# Altium schematic sheet FPGA_Core.SchDoc: FPGA Core Module
size 420 x 297 mm; DocumentNumber: 8; SheetNumber: 8; SheetTotal: 16
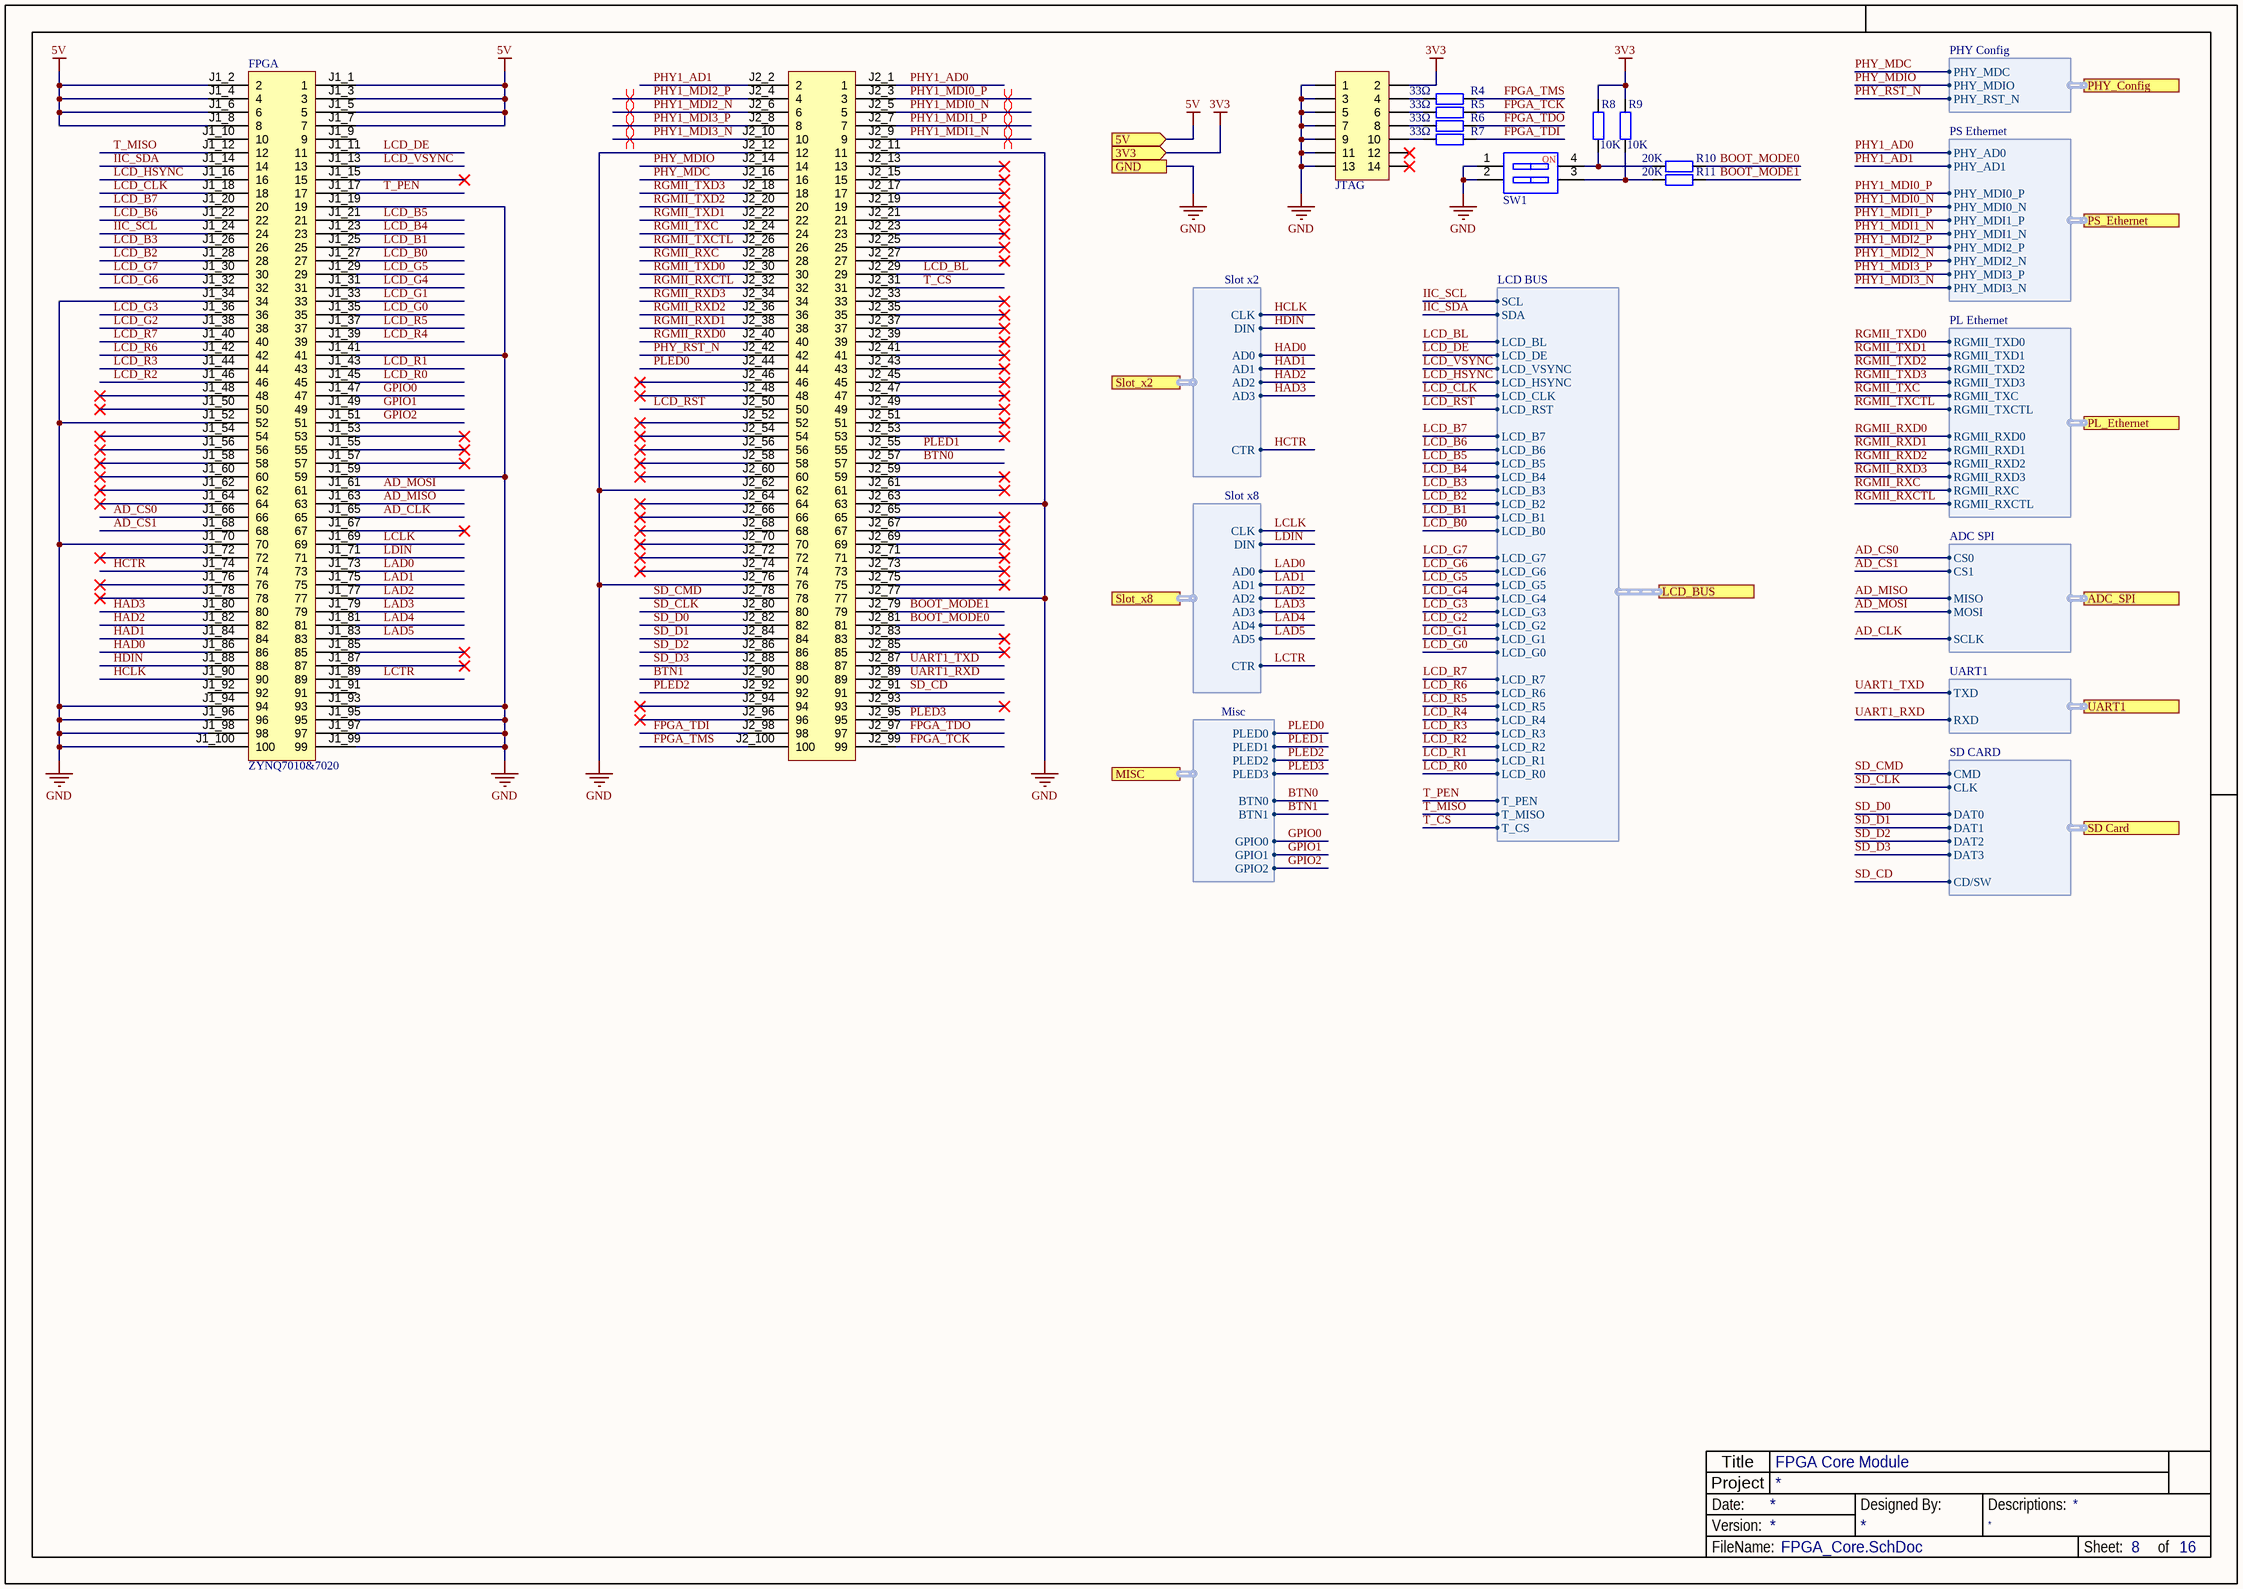
[diagram p0: FPGA_Core.SchDoc]

## Parts
FPGA  ZYNQ7010&7020  [ZYNQ7010&7020_CB]
JTAG  Header 2X7  [IDC2.54-LI-2x7P]  (value not drawn)
R4  33Ω  [R 0603_L]
R5  33Ω  [R 0603_L]
R6  33Ω  [R 0603_L]
R7  33Ω  [R 0603_L]
R8  10K  [R 0603_L]
R9  10K  [R 0603_L]
R10  20K  [R 0603_L]
R11  20K  [R 0603_L]
SW1  SW-2P  [CSW DIP-2P]  (value not drawn)

## Ports
3V3 (in), 5V (in), ADC_SPI (harness ADC SPI), GND, LCD_BUS (harness LCD BUS), MISC (harness Misc), PHY_Config (harness PHY Config), PL_Ethernet (harness PL Ethernet), PS_Ethernet (harness PS Ethernet), SD Card (harness SD CARD), Slot_x2 (harness Slot x2), Slot_x8 (harness Slot x8), UART1 (harness UART1)

## Harnesses
Slot x2: CLK, DIN, AD0, AD1, AD2, AD3, CTR
Slot x8: CLK, DIN, AD0, AD1, AD2, AD3, AD4, AD5, CTR
PHY Config: PHY_MDC, PHY_MDIO, PHY_RST_N
PS Ethernet: PHY_AD0, PHY_AD1, PHY_MDI0_P, PHY_MDI0_N, PHY_MDI1_P, PHY_MDI1_N, PHY_MDI2_P, PHY_MDI2_N, PHY_MDI3_P, PHY_MDI3_N
PL Ethernet: RGMII_TXD0, RGMII_TXD1, RGMII_TXD2, RGMII_TXD3, RGMII_TXC, RGMII_TXCTL, RGMII_RXD0, RGMII_RXD1, RGMII_RXD2, RGMII_RXD3, RGMII_RXC, RGMII_RXCTL
ADC SPI: CS0, CS1, MISO, MOSI, SCLK
UART1: TXD, RXD
SD CARD: CMD, CLK, DAT0, DAT1, DAT2, DAT3, CD/SW
LCD BUS: SCL, SDA, LCD_R0, LCD_R1, LCD_R2, LCD_R3, LCD_R4, LCD_R5, LCD_R6, LCD_R7, LCD_G0, LCD_G1, LCD_G2, LCD_G3, LCD_G4, LCD_G5, LCD_G6, LCD_G7, LCD_B0, LCD_B1, LCD_B2, LCD_B3, LCD_B4, LCD_B5, LCD_B6, LCD_B7, LCD_RST, LCD_CLK, LCD_HSYNC, LCD_VSYNC, LCD_DE, LCD_BL, T_PEN, T_MISO, T_CS
Misc: PLED0, PLED1, PLED2, PLED3, BTN1, BTN0, GPIO0, GPIO1, GPIO2

## Nets
3V3: JTAG.2 R8.2 R9.2 ; port 3V3
5V: FPGA.J1_1(1) FPGA.J1_2(2) FPGA.J1_3(3) FPGA.J1_4(4) FPGA.J1_5(5) FPGA.J1_6(6) FPGA.J1_7(7) FPGA.J1_8(8) ; port 5V
GND: FPGA.J1_19(19) FPGA.J1_34(34) FPGA.J1_41(41) FPGA.J1_52(52) FPGA.J1_59(59) FPGA.J1_70(70) FPGA.J1_93(93) FPGA.J1_94(94) FPGA.J1_95(95) FPGA.J1_96(96) FPGA.J1_97(97) FPGA.J1_98(98) FPGA.J1_99(99) FPGA.J1_100(100) FPGA.J2_11(11) FPGA.J2_12(12) FPGA.J2_62(62) FPGA.J2_63(63) FPGA.J2_76(76) FPGA.J2_77(77) JTAG.1 JTAG.3 JTAG.5 JTAG.7 JTAG.9 JTAG.11 JTAG.13 SW1.1 SW1.2 ; port GND
AD_CLK: FPGA.J1_65(65) ; port ADC_SPI.SCLK
AD_CS0: FPGA.J1_66(66) ; port ADC_SPI.CS0
AD_CS1: FPGA.J1_68(68) ; port ADC_SPI.CS1
AD_MISO: FPGA.J1_63(63) ; port ADC_SPI.MISO
AD_MOSI: FPGA.J1_61(61) ; port ADC_SPI.MOSI
BOOT_MODE0: FPGA.J2_81(81) R10.2
BOOT_MODE1: FPGA.J2_79(79) R11.2
BTN0: FPGA.J2_57(57) ; port MISC.BTN0
BTN1: FPGA.J2_90(90) ; port MISC.BTN1
FPGA_TCK: FPGA.J2_99(99) R5.2
FPGA_TDI: FPGA.J2_98(98) R7.2
FPGA_TDO: FPGA.J2_97(97) R6.2
FPGA_TMS: FPGA.J2_100(100) R4.2
GPIO0: FPGA.J1_47(47) ; port MISC.GPIO0
GPIO1: FPGA.J1_49(49) ; port MISC.GPIO1
GPIO2: FPGA.J1_51(51) ; port MISC.GPIO2
HAD0: FPGA.J1_86(86) ; port Slot_x2.AD0
HAD1: FPGA.J1_84(84) ; port Slot_x2.AD1
HAD2: FPGA.J1_82(82) ; port Slot_x2.AD2
HAD3: FPGA.J1_80(80) ; port Slot_x2.AD3
HCLK: FPGA.J1_90(90) ; port Slot_x2.CLK
HCTR: FPGA.J1_74(74) ; port Slot_x2.CTR
HDIN: FPGA.J1_88(88) ; port Slot_x2.DIN
IIC_SCL: FPGA.J1_24(24) ; port LCD_BUS.SCL
IIC_SDA: FPGA.J1_14(14) ; port LCD_BUS.SDA
LAD0: FPGA.J1_73(73) ; port Slot_x8.AD0
LAD1: FPGA.J1_75(75) ; port Slot_x8.AD1
LAD2: FPGA.J1_77(77) ; port Slot_x8.AD2
LAD3: FPGA.J1_79(79) ; port Slot_x8.AD3
LAD4: FPGA.J1_81(81) ; port Slot_x8.AD4
LAD5: FPGA.J1_83(83) ; port Slot_x8.AD5
LCD_B0: FPGA.J1_27(27) ; port LCD_BUS.LCD_B0
LCD_B1: FPGA.J1_25(25) ; port LCD_BUS.LCD_B1
LCD_B2: FPGA.J1_28(28) ; port LCD_BUS.LCD_B2
LCD_B3: FPGA.J1_26(26) ; port LCD_BUS.LCD_B3
LCD_B4: FPGA.J1_23(23) ; port LCD_BUS.LCD_B4
LCD_B5: FPGA.J1_21(21) ; port LCD_BUS.LCD_B5
LCD_B6: FPGA.J1_22(22) ; port LCD_BUS.LCD_B6
LCD_B7: FPGA.J1_20(20) ; port LCD_BUS.LCD_B7
LCD_BL: FPGA.J2_29(29) ; port LCD_BUS.LCD_BL
LCD_CLK: FPGA.J1_18(18) ; port LCD_BUS.LCD_CLK
LCD_DE: FPGA.J1_11(11) ; port LCD_BUS.LCD_DE
LCD_G0: FPGA.J1_35(35) ; port LCD_BUS.LCD_G0
LCD_G1: FPGA.J1_33(33) ; port LCD_BUS.LCD_G1
LCD_G2: FPGA.J1_38(38) ; port LCD_BUS.LCD_G2
LCD_G3: FPGA.J1_36(36) ; port LCD_BUS.LCD_G3
LCD_G4: FPGA.J1_31(31) ; port LCD_BUS.LCD_G4
LCD_G5: FPGA.J1_29(29) ; port LCD_BUS.LCD_G5
LCD_G6: FPGA.J1_32(32) ; port LCD_BUS.LCD_G6
LCD_G7: FPGA.J1_30(30) ; port LCD_BUS.LCD_G7
LCD_HSYNC: FPGA.J1_16(16) ; port LCD_BUS.LCD_HSYNC
LCD_R0: FPGA.J1_45(45) ; port LCD_BUS.LCD_R0
LCD_R1: FPGA.J1_43(43) ; port LCD_BUS.LCD_R1
LCD_R2: FPGA.J1_46(46) ; port LCD_BUS.LCD_R2
LCD_R3: FPGA.J1_44(44) ; port LCD_BUS.LCD_R3
LCD_R4: FPGA.J1_39(39) ; port LCD_BUS.LCD_R4
LCD_R5: FPGA.J1_37(37) ; port LCD_BUS.LCD_R5
LCD_R6: FPGA.J1_42(42) ; port LCD_BUS.LCD_R6
LCD_R7: FPGA.J1_40(40) ; port LCD_BUS.LCD_R7
LCD_RST: FPGA.J2_50(50) ; port LCD_BUS.LCD_RST
LCD_VSYNC: FPGA.J1_13(13) ; port LCD_BUS.LCD_VSYNC
LCLK: FPGA.J1_69(69) ; port Slot_x8.CLK
LCTR: FPGA.J1_89(89) ; port Slot_x8.CTR
LDIN: FPGA.J1_71(71) ; port Slot_x8.DIN
PHY1_AD0: FPGA.J2_1(1) ; port PS_Ethernet.PHY_AD0
PHY1_AD1: FPGA.J2_2(2) ; port PS_Ethernet.PHY_AD1
PHY1_MDI0_N: FPGA.J2_5(5) ; port PS_Ethernet.PHY_MDI0_N
PHY1_MDI0_P: FPGA.J2_3(3) ; port PS_Ethernet.PHY_MDI0_P
PHY1_MDI1_N: FPGA.J2_9(9) ; port PS_Ethernet.PHY_MDI1_N
PHY1_MDI1_P: FPGA.J2_7(7) ; port PS_Ethernet.PHY_MDI1_P
PHY1_MDI2_N: FPGA.J2_6(6) ; port PS_Ethernet.PHY_MDI2_N
PHY1_MDI2_P: FPGA.J2_4(4) ; port PS_Ethernet.PHY_MDI2_P
PHY1_MDI3_N: FPGA.J2_10(10) ; port PS_Ethernet.PHY_MDI3_N
PHY1_MDI3_P: FPGA.J2_8(8) ; port PS_Ethernet.PHY_MDI3_P
PHY_MDC: FPGA.J2_16(16) ; port PHY_Config.PHY_MDC
PHY_MDIO: FPGA.J2_14(14) ; port PHY_Config.PHY_MDIO
PHY_RST_N: FPGA.J2_42(42) ; port PHY_Config.PHY_RST_N
PLED0: FPGA.J2_44(44) ; port MISC.PLED0
PLED1: FPGA.J2_55(55) ; port MISC.PLED1
PLED2: FPGA.J2_92(92) ; port MISC.PLED2
PLED3: FPGA.J2_95(95) ; port MISC.PLED3
RGMII_RXC: FPGA.J2_28(28) ; port PL_Ethernet.RGMII_RXC
RGMII_RXCTL: FPGA.J2_32(32) ; port PL_Ethernet.RGMII_RXCTL
RGMII_RXD0: FPGA.J2_40(40) ; port PL_Ethernet.RGMII_RXD0
RGMII_RXD1: FPGA.J2_38(38) ; port PL_Ethernet.RGMII_RXD1
RGMII_RXD2: FPGA.J2_36(36) ; port PL_Ethernet.RGMII_RXD2
RGMII_RXD3: FPGA.J2_34(34) ; port PL_Ethernet.RGMII_RXD3
RGMII_TXC: FPGA.J2_24(24) ; port PL_Ethernet.RGMII_TXC
RGMII_TXCTL: FPGA.J2_26(26) ; port PL_Ethernet.RGMII_TXCTL
RGMII_TXD0: FPGA.J2_30(30) ; port PL_Ethernet.RGMII_TXD0
RGMII_TXD1: FPGA.J2_22(22) ; port PL_Ethernet.RGMII_TXD1
RGMII_TXD2: FPGA.J2_20(20) ; port PL_Ethernet.RGMII_TXD2
RGMII_TXD3: FPGA.J2_18(18) ; port PL_Ethernet.RGMII_TXD3
SD_CD: FPGA.J2_91(91) ; port SD Card.CD/SW
SD_CLK: FPGA.J2_80(80) ; port SD Card.CLK
SD_CMD: FPGA.J2_78(78) ; port SD Card.CMD
SD_D0: FPGA.J2_82(82) ; port SD Card.DAT0
SD_D1: FPGA.J2_84(84) ; port SD Card.DAT1
SD_D2: FPGA.J2_86(86) ; port SD Card.DAT2
SD_D3: FPGA.J2_88(88) ; port SD Card.DAT3
T_CS: FPGA.J2_31(31) ; port LCD_BUS.T_CS
T_MISO: FPGA.J1_12(12) ; port LCD_BUS.T_MISO
T_PEN: FPGA.J1_17(17) ; port LCD_BUS.T_PEN
UART1_RXD: FPGA.J2_89(89) ; port UART1.RXD
UART1_TXD: FPGA.J2_87(87) ; port UART1.TXD
NetJTAG_4: JTAG.4 R4.1
NetJTAG_6: JTAG.6 R5.1
NetJTAG_8: JTAG.8 R6.1
NetJTAG_10: JTAG.10 R7.1
NetR8_1: R8.1 R10.1 SW1.4
NetR9_1: R9.1 R11.1 SW1.3

Not connected (* = marked no-connect by the designer): FPGA J1_9(9) J1_10(10) J1_15(15)* J1_48(48)* J1_50(50)* J1_53(53)* J1_54(54)* J1_55(55)* J1_56(56)* J1_57(57)* J1_58(58)* J1_60(60)* J1_62(62)* J1_64(64)* J1_67(67)* J1_72(72)* J1_76(76)* J1_78(78)* J1_85(85)* J1_87(87)* J1_91(91) J1_92(92) J2_13(13)* J2_15(15)* J2_17(17)* J2_19(19)* J2_21(21)* J2_23(23)* J2_25(25)* J2_27(27)* J2_33(33)* J2_35(35)* J2_37(37)* J2_39(39)* J2_41(41)* J2_43(43)* J2_45(45)* J2_46(46)* J2_47(47)* J2_48(48)* J2_49(49)* J2_51(51)* J2_52(52)* J2_53(53)* J2_54(54)* J2_56(56)* J2_58(58)* J2_59(59)* J2_60(60)* J2_61(61)* J2_64(64)* J2_65(65)* J2_66(66)* J2_67(67)* J2_68(68)* J2_69(69)* J2_70(70)* J2_71(71)* J2_72(72)* J2_73(73)* J2_74(74)* J2_75(75)* J2_83(83)* J2_85(85)* J2_93(93)* J2_94(94)* J2_96(96)*; JTAG 12* 14*

## Layout directives
differential pair: PHY1_MDI0_N, PHY1_MDI0_P, PHY1_MDI1_N, PHY1_MDI1_P, PHY1_MDI2_N, PHY1_MDI2_P, PHY1_MDI3_N, PHY1_MDI3_P

## Notes on the sheet
- Title
- FileName:
- Version:
- Date:
- Project
- Designed By:
- Descriptions:
- Sheet:
- of
- (in symbol SW-2P) NO

## Library data of the parts
FPGA = ZYNQ7010&7020: ZYNQ7010&7020 Core Board
JTAG = Header 7X2: 7*2P接插件; 版权归属: 封装库来自淘宝 ID：黄晶宝石; BOM名称: 7*2P接插件; 学习资源: https://shop463601444.taobao.com
R4-R11 = R: 贴片电阻; 版权归属: 来自淘宝 ID：黄晶宝石; 封装库来自淘宝卖家 ID：黄晶宝石: 其他店铺购入均为盗版，不享受售后技术支持服务，请立即申请退款; BOM名称: 贴片电阻; 联系售后: https://shop463601444.taobao.com
SW1 = SW-2P: 2路编码开关 / *LCID: C976324; 淘宝ID: 黄晶宝石; BOM名称: 2路编码开关; 学习资源: https://shop463601444.taobao.com